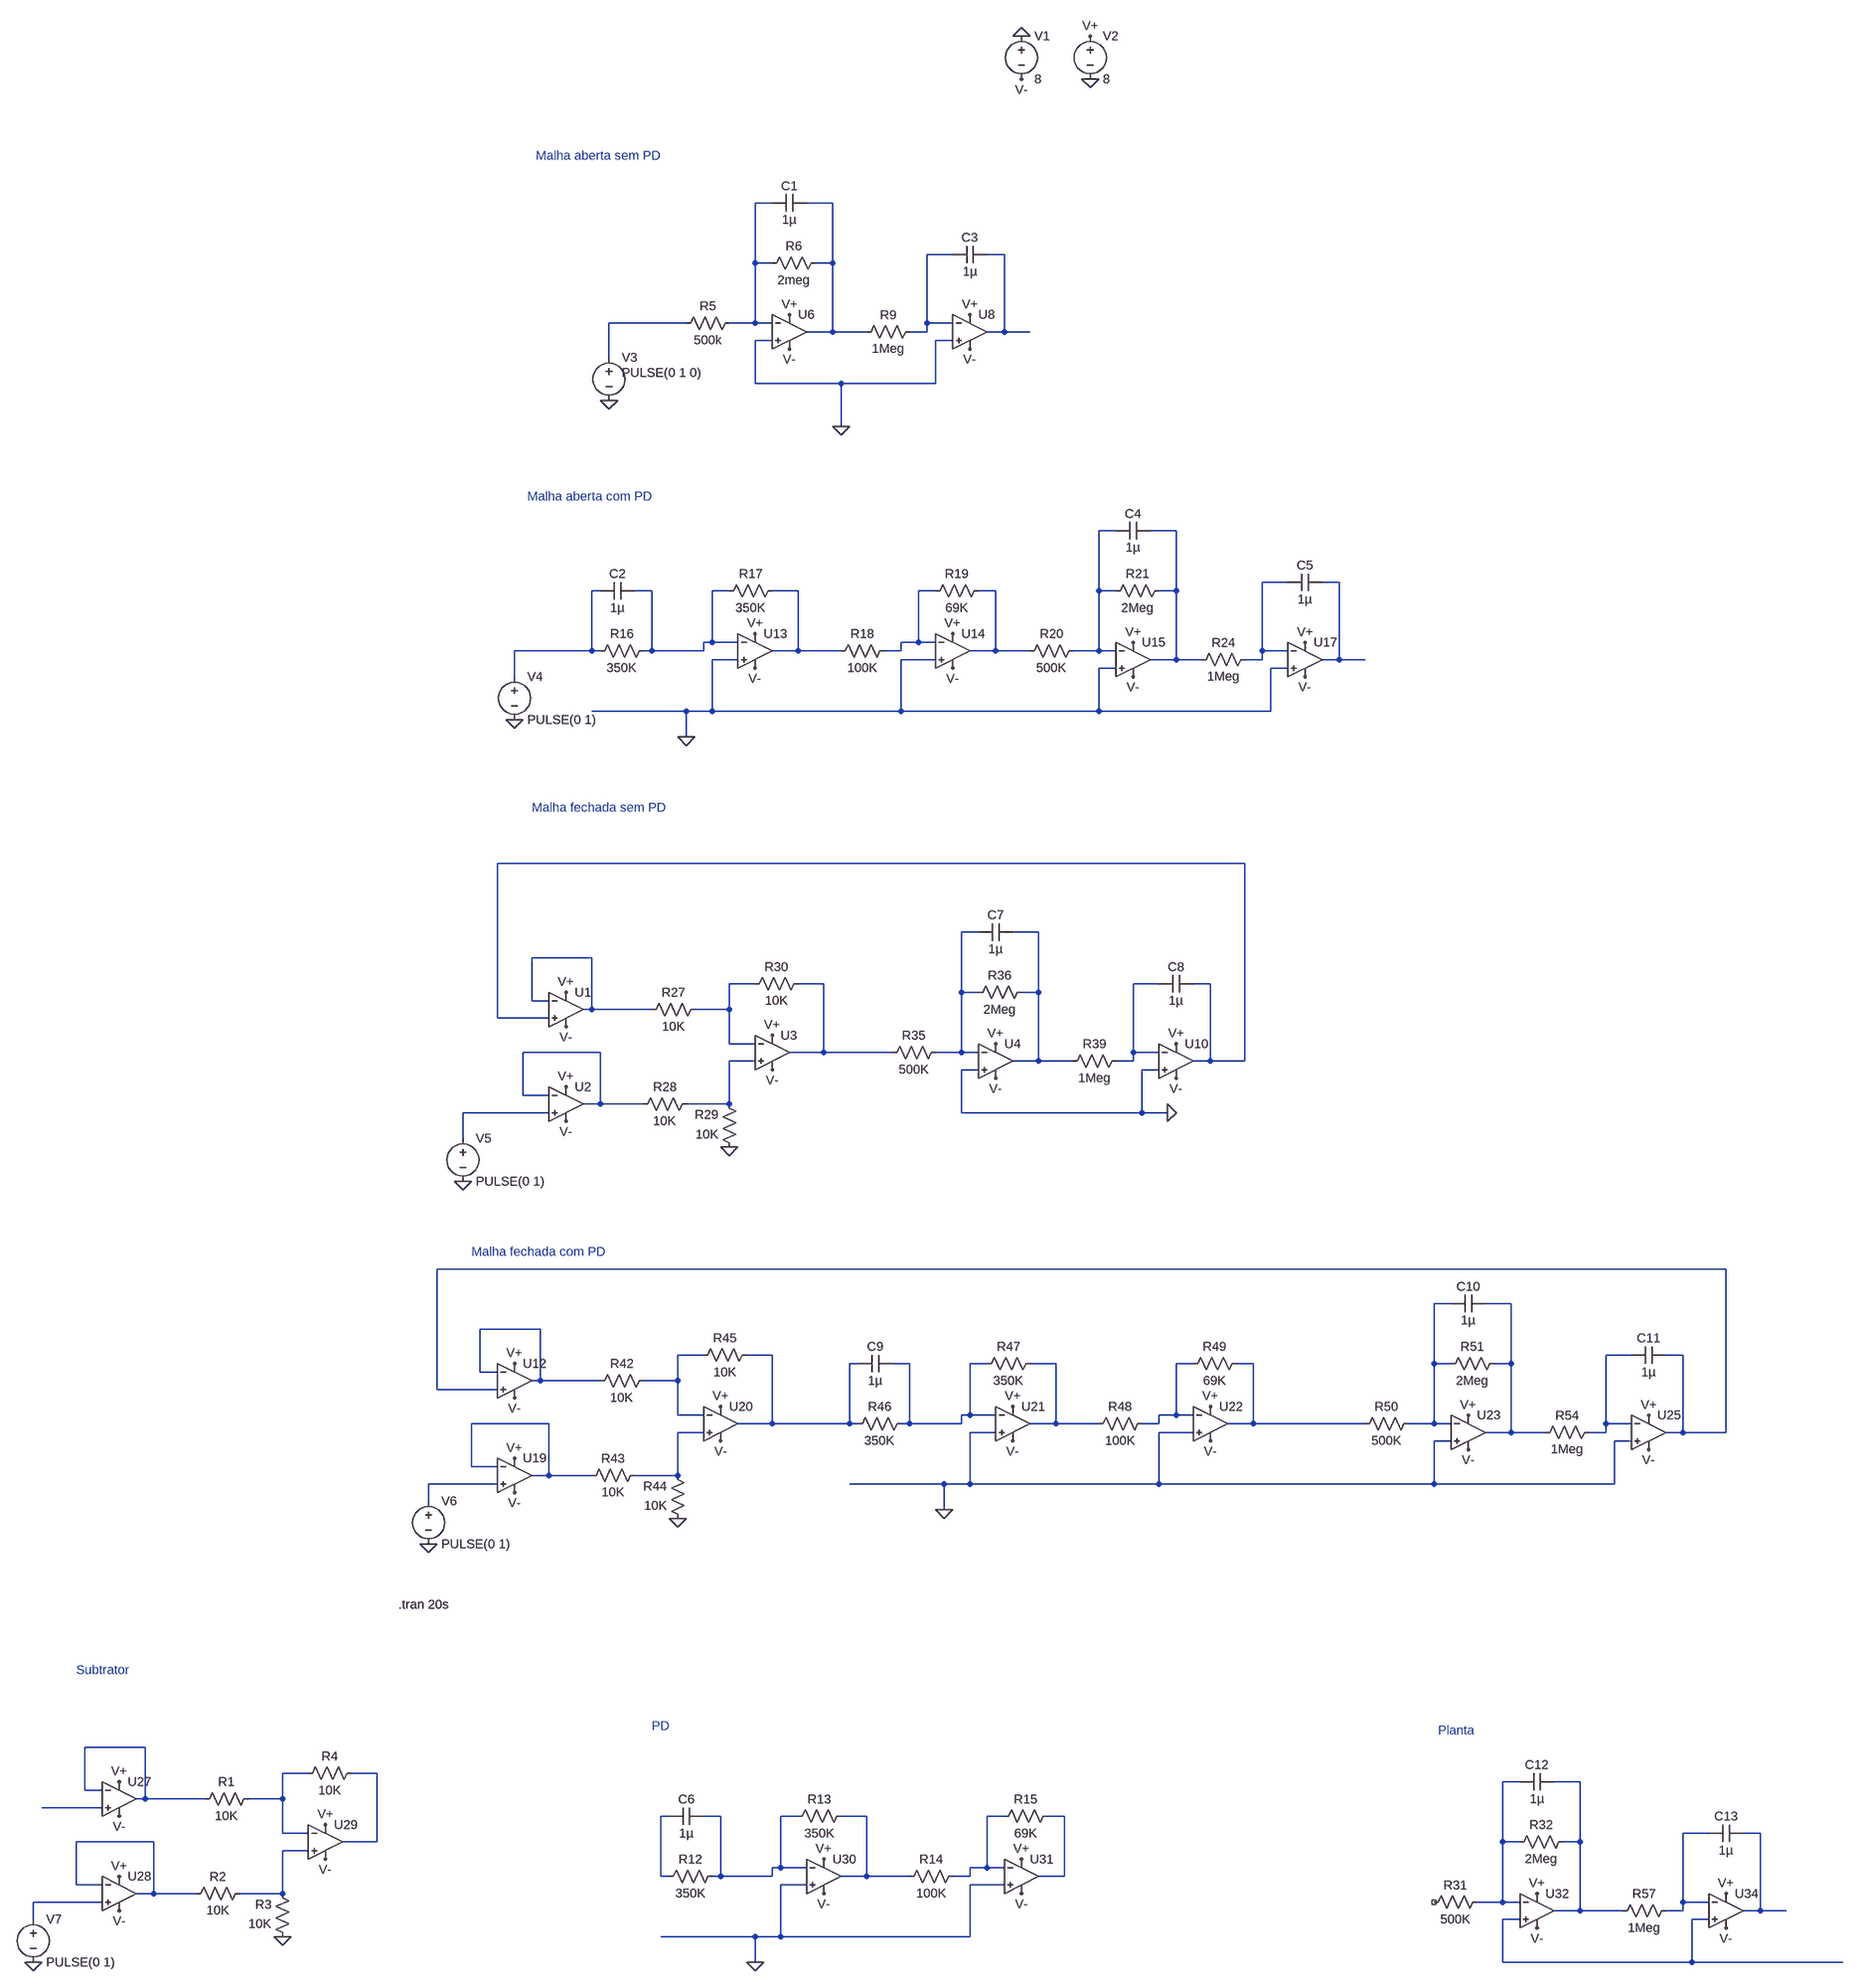
[diagram p0: schematic ProjetoControle.asc]
ProjetoControle.asc, the LTspice schematic file:
Version 4
SHEET 1 2676 3508
WIRE -224 -80 -256 -80
WIRE -112 -80 -160 -80
WIRE 112 16 64 16
WIRE 208 16 176 16
WIRE -256 32 -256 -80
WIRE -224 32 -256 32
WIRE -112 32 -112 -80
WIRE -112 32 -144 32
WIRE -384 144 -528 144
WIRE -256 144 -256 32
WIRE -256 144 -304 144
WIRE -224 144 -256 144
WIRE 64 144 64 16
WIRE 112 144 64 144
WIRE -112 160 -112 32
WIRE -112 160 -160 160
WIRE -48 160 -112 160
WIRE 64 160 64 144
WIRE 64 160 32 160
WIRE 208 160 208 16
WIRE 208 160 176 160
WIRE 256 160 208 160
WIRE -224 176 -256 176
WIRE 112 176 80 176
WIRE -528 208 -528 144
WIRE -256 256 -256 176
WIRE -96 256 -256 256
WIRE 80 256 80 176
WIRE 80 256 -96 256
WIRE -96 336 -96 256
WIRE 416 640 384 640
WIRE 528 640 480 640
WIRE 736 736 688 736
WIRE 832 736 800 736
WIRE -544 752 -560 752
WIRE -448 752 -480 752
WIRE -304 752 -336 752
WIRE -176 752 -224 752
WIRE 80 752 48 752
WIRE 192 752 160 752
WIRE 384 752 384 640
WIRE 416 752 384 752
WIRE 528 752 528 640
WIRE 528 752 496 752
WIRE -336 848 -336 752
WIRE -336 848 -352 848
WIRE -288 848 -336 848
WIRE 48 848 48 752
WIRE 48 848 16 848
WIRE 80 848 48 848
WIRE -560 864 -560 752
WIRE -560 864 -704 864
WIRE -544 864 -560 864
WIRE -448 864 -448 752
WIRE -448 864 -464 864
WIRE -352 864 -352 848
WIRE -352 864 -448 864
WIRE -176 864 -176 752
WIRE -176 864 -224 864
WIRE -96 864 -176 864
WIRE 16 864 16 848
WIRE 16 864 -16 864
WIRE 192 864 192 752
WIRE 192 864 144 864
WIRE 256 864 192 864
WIRE 384 864 384 752
WIRE 384 864 336 864
WIRE 416 864 384 864
WIRE 688 864 688 736
WIRE 736 864 688 864
WIRE -288 880 -336 880
WIRE 80 880 16 880
WIRE 528 880 528 752
WIRE 528 880 480 880
WIRE 576 880 528 880
WIRE 688 880 688 864
WIRE 688 880 656 880
WIRE 832 880 832 736
WIRE 832 880 800 880
WIRE 880 880 832 880
WIRE 416 896 384 896
WIRE 736 896 704 896
WIRE -704 912 -704 864
WIRE -384 976 -560 976
WIRE -336 976 -336 880
WIRE -336 976 -384 976
WIRE 16 976 16 880
WIRE 16 976 -336 976
WIRE 384 976 384 896
WIRE 384 976 16 976
WIRE 704 976 704 896
WIRE 704 976 384 976
WIRE -384 1024 -384 976
WIRE 656 1296 -736 1296
WIRE 160 1424 128 1424
WIRE 272 1424 224 1424
WIRE -560 1472 -672 1472
WIRE -256 1520 -304 1520
WIRE -128 1520 -176 1520
WIRE 496 1520 448 1520
WIRE 592 1520 560 1520
WIRE 128 1536 128 1424
WIRE 160 1536 128 1536
WIRE 272 1536 272 1424
WIRE 272 1536 240 1536
WIRE -672 1552 -672 1472
WIRE -640 1552 -672 1552
WIRE -560 1568 -560 1472
WIRE -560 1568 -576 1568
WIRE -448 1568 -560 1568
WIRE -304 1568 -304 1520
WIRE -304 1568 -368 1568
WIRE -736 1584 -736 1296
WIRE -640 1584 -736 1584
WIRE -304 1632 -304 1568
WIRE -256 1632 -304 1632
WIRE -544 1648 -688 1648
WIRE -128 1648 -128 1520
WIRE -128 1648 -192 1648
WIRE 0 1648 -128 1648
WIRE 128 1648 128 1536
WIRE 128 1648 80 1648
WIRE 160 1648 128 1648
WIRE 448 1648 448 1520
WIRE 496 1648 448 1648
WIRE -256 1664 -304 1664
WIRE 272 1664 272 1536
WIRE 272 1664 224 1664
WIRE 336 1664 272 1664
WIRE 448 1664 448 1648
WIRE 448 1664 416 1664
WIRE 592 1664 592 1520
WIRE 592 1664 560 1664
WIRE 656 1664 656 1296
WIRE 656 1664 592 1664
WIRE 160 1680 128 1680
WIRE 496 1680 464 1680
WIRE -688 1728 -688 1648
WIRE -640 1728 -688 1728
WIRE -544 1744 -544 1648
WIRE -544 1744 -576 1744
WIRE -464 1744 -544 1744
WIRE -304 1744 -304 1664
WIRE -304 1744 -384 1744
WIRE -640 1760 -800 1760
WIRE 128 1760 128 1680
WIRE 464 1760 464 1680
WIRE 464 1760 128 1760
WIRE 512 1760 464 1760
WIRE -800 1808 -800 1760
WIRE 1552 2096 -848 2096
WIRE 1040 2160 1008 2160
WIRE 1152 2160 1104 2160
WIRE -656 2208 -768 2208
WIRE -352 2256 -400 2256
WIRE -224 2256 -272 2256
WIRE 1376 2256 1328 2256
WIRE 1472 2256 1440 2256
WIRE -64 2272 -80 2272
WIRE 32 2272 0 2272
WIRE 176 2272 144 2272
WIRE 304 2272 256 2272
WIRE 560 2272 528 2272
WIRE 672 2272 640 2272
WIRE 1008 2272 1008 2160
WIRE 1040 2272 1008 2272
WIRE 1152 2272 1152 2160
WIRE 1152 2272 1120 2272
WIRE -768 2288 -768 2208
WIRE -736 2288 -768 2288
WIRE -656 2304 -656 2208
WIRE -656 2304 -672 2304
WIRE -544 2304 -656 2304
WIRE -400 2304 -400 2256
WIRE -400 2304 -464 2304
WIRE -848 2320 -848 2096
WIRE -736 2320 -848 2320
WIRE -400 2368 -400 2304
WIRE -352 2368 -400 2368
WIRE 144 2368 144 2272
WIRE 144 2368 128 2368
WIRE 192 2368 144 2368
WIRE 528 2368 528 2272
WIRE 528 2368 496 2368
WIRE 560 2368 528 2368
WIRE -640 2384 -784 2384
WIRE -224 2384 -224 2256
WIRE -224 2384 -288 2384
WIRE -80 2384 -80 2272
WIRE -80 2384 -224 2384
WIRE -64 2384 -80 2384
WIRE 32 2384 32 2272
WIRE 32 2384 16 2384
WIRE 128 2384 128 2368
WIRE 128 2384 32 2384
WIRE 304 2384 304 2272
WIRE 304 2384 256 2384
WIRE 384 2384 304 2384
WIRE 496 2384 496 2368
WIRE 496 2384 464 2384
WIRE 672 2384 672 2272
WIRE 672 2384 624 2384
WIRE 880 2384 672 2384
WIRE 1008 2384 1008 2272
WIRE 1008 2384 960 2384
WIRE 1040 2384 1008 2384
WIRE 1328 2384 1328 2256
WIRE 1376 2384 1328 2384
WIRE -352 2400 -400 2400
WIRE 192 2400 144 2400
WIRE 560 2400 496 2400
WIRE 1152 2400 1152 2272
WIRE 1152 2400 1104 2400
WIRE 1216 2400 1152 2400
WIRE 1328 2400 1328 2384
WIRE 1328 2400 1296 2400
WIRE 1472 2400 1472 2256
WIRE 1472 2400 1440 2400
WIRE 1552 2400 1552 2096
WIRE 1552 2400 1472 2400
WIRE 1040 2416 1008 2416
WIRE 1376 2416 1344 2416
WIRE -784 2464 -784 2384
WIRE -736 2464 -784 2464
WIRE -640 2480 -640 2384
WIRE -640 2480 -672 2480
WIRE -560 2480 -640 2480
WIRE -400 2480 -400 2400
WIRE -400 2480 -480 2480
WIRE -736 2496 -864 2496
WIRE 96 2496 -80 2496
WIRE 144 2496 144 2400
WIRE 144 2496 96 2496
WIRE 496 2496 496 2400
WIRE 496 2496 144 2496
WIRE 1008 2496 1008 2416
WIRE 1008 2496 496 2496
WIRE 1344 2496 1344 2416
WIRE 1344 2496 1008 2496
WIRE -864 2528 -864 2496
WIRE 96 2544 96 2496
WIRE -1392 3088 -1504 3088
WIRE -1088 3136 -1136 3136
WIRE -960 3136 -1008 3136
WIRE 1168 3152 1136 3152
WIRE 1280 3152 1232 3152
WIRE -1504 3168 -1504 3088
WIRE -1472 3168 -1504 3168
WIRE -1392 3184 -1392 3088
WIRE -1392 3184 -1408 3184
WIRE -1280 3184 -1392 3184
WIRE -1136 3184 -1136 3136
WIRE -1136 3184 -1200 3184
WIRE -1472 3200 -1584 3200
WIRE -416 3216 -432 3216
WIRE -320 3216 -352 3216
WIRE -176 3216 -208 3216
WIRE -48 3216 -96 3216
WIRE 208 3216 176 3216
WIRE 320 3216 288 3216
WIRE -1136 3248 -1136 3184
WIRE -1088 3248 -1136 3248
WIRE 1520 3248 1472 3248
WIRE 1616 3248 1584 3248
WIRE -1376 3264 -1520 3264
WIRE -960 3264 -960 3136
WIRE -960 3264 -1024 3264
WIRE 1136 3264 1136 3152
WIRE 1168 3264 1136 3264
WIRE 1280 3264 1280 3152
WIRE 1280 3264 1248 3264
WIRE -1088 3280 -1136 3280
WIRE -208 3312 -208 3216
WIRE -208 3312 -224 3312
WIRE -160 3312 -208 3312
WIRE 176 3312 176 3216
WIRE 176 3312 144 3312
WIRE 208 3312 176 3312
WIRE -432 3328 -432 3216
WIRE -416 3328 -432 3328
WIRE -320 3328 -320 3216
WIRE -320 3328 -336 3328
WIRE -224 3328 -224 3312
WIRE -224 3328 -320 3328
WIRE -48 3328 -48 3216
WIRE -48 3328 -96 3328
WIRE 32 3328 -48 3328
WIRE 144 3328 144 3312
WIRE 144 3328 112 3328
WIRE 320 3328 320 3216
WIRE 320 3328 272 3328
WIRE -1520 3344 -1520 3264
WIRE -1472 3344 -1520 3344
WIRE -160 3344 -208 3344
WIRE 208 3344 144 3344
WIRE -1376 3360 -1376 3264
WIRE -1376 3360 -1408 3360
WIRE -1296 3360 -1376 3360
WIRE -1136 3360 -1136 3280
WIRE -1136 3360 -1216 3360
WIRE -1472 3376 -1600 3376
WIRE 1136 3376 1136 3264
WIRE 1136 3376 1088 3376
WIRE 1168 3376 1136 3376
WIRE 1472 3376 1472 3248
WIRE 1520 3376 1472 3376
WIRE 1280 3392 1280 3264
WIRE 1280 3392 1232 3392
WIRE 1360 3392 1280 3392
WIRE 1472 3392 1472 3376
WIRE 1472 3392 1440 3392
WIRE 1616 3392 1616 3248
WIRE 1616 3392 1584 3392
WIRE 1664 3392 1616 3392
WIRE -1600 3408 -1600 3376
WIRE 1168 3408 1136 3408
WIRE 1520 3408 1488 3408
WIRE -256 3440 -432 3440
WIRE -208 3440 -208 3344
WIRE -208 3440 -256 3440
WIRE 144 3440 144 3344
WIRE 144 3440 -208 3440
WIRE -256 3488 -256 3440
WIRE 1136 3488 1136 3408
WIRE 1488 3488 1488 3408
WIRE 1488 3488 1136 3488
WIRE 1776 3488 1488 3488
FLAG 368 -512 0
FLAG 240 -592 0
FLAG 368 -592 V+
FLAG -192 128 V+
FLAG 144 128 V+
FLAG 240 -512 V-
FLAG -192 192 V-
FLAG 144 192 V-
FLAG -384 1024 0
FLAG -256 832 V+
FLAG 112 832 V+
FLAG 448 848 V+
FLAG 768 848 V+
FLAG -256 896 V-
FLAG 112 896 V-
FLAG 448 912 V-
FLAG 768 912 V-
FLAG -304 1824 0
FLAG -608 1536 V+
FLAG -608 1712 V+
FLAG -224 1616 V+
FLAG 192 1632 V+
FLAG 528 1632 V+
FLAG -608 1600 V-
FLAG -608 1776 V-
FLAG -224 1680 V-
FLAG 192 1696 V-
FLAG 528 1696 V-
FLAG -400 2560 0
FLAG 96 2544 0
FLAG -704 2272 V+
FLAG -704 2448 V+
FLAG -320 2352 V+
FLAG 224 2352 V+
FLAG 592 2352 V+
FLAG 1072 2368 V+
FLAG 1408 2368 V+
FLAG -704 2336 V-
FLAG -704 2512 V-
FLAG -320 2416 V-
FLAG 224 2416 V-
FLAG 592 2416 V-
FLAG 1072 2432 V-
FLAG 1408 2432 V-
FLAG 512 1760 0
FLAG -704 992 0
FLAG -800 1888 0
FLAG -864 2608 0
FLAG -528 288 0
FLAG -96 336 0
FLAG -1136 3440 0
FLAG -256 3488 0
FLAG -1440 3152 V+
FLAG -1440 3328 V+
FLAG -1056 3232 V+
FLAG -128 3296 V+
FLAG 240 3296 V+
FLAG 1200 3360 V+
FLAG 1552 3360 V+
FLAG -1440 3216 V-
FLAG -1440 3392 V-
FLAG -1056 3296 V-
FLAG -128 3360 V-
FLAG 240 3360 V-
FLAG 1200 3424 V-
FLAG 1552 3424 V-
FLAG -1600 3488 0
SYMBOL res -288 128 R90
WINDOW 0 0 56 VBottom 2
WINDOW 3 32 56 VTop 2
SYMATTR InstName R5
SYMATTR Value 500k
SYMBOL res -128 16 R90
WINDOW 0 0 56 VBottom 2
WINDOW 3 32 56 VTop 2
SYMATTR InstName R6
SYMATTR Value 2meg
SYMBOL res 48 144 R90
WINDOW 0 0 56 VBottom 2
WINDOW 3 32 56 VTop 2
SYMATTR InstName R9
SYMATTR Value 1Meg
SYMBOL cap -160 -96 R90
WINDOW 0 0 32 VBottom 2
WINDOW 3 32 32 VTop 2
SYMATTR InstName C1
SYMATTR Value 1µ
SYMBOL cap 176 0 R90
WINDOW 0 0 32 VBottom 2
WINDOW 3 32 32 VTop 2
SYMATTR InstName C3
SYMATTR Value 1µ
SYMBOL voltage 240 -608 R0
WINDOW 123 0 0 Left 2
WINDOW 39 0 0 Left 2
SYMATTR InstName V1
SYMATTR Value 8
SYMBOL voltage 368 -608 R0
WINDOW 123 0 0 Left 2
WINDOW 39 0 0 Left 2
SYMATTR InstName V2
SYMATTR Value 8
SYMBOL res -448 848 R90
WINDOW 0 0 56 VBottom 2
WINDOW 3 32 56 VTop 2
SYMATTR InstName R16
SYMATTR Value 350K
SYMBOL cap -480 736 R90
WINDOW 0 0 32 VBottom 2
WINDOW 3 32 32 VTop 2
SYMATTR InstName C2
SYMATTR Value 1µ
SYMBOL res -208 736 R90
WINDOW 0 0 56 VBottom 2
WINDOW 3 32 56 VTop 2
SYMATTR InstName R17
SYMATTR Value 350K
SYMBOL res 0 848 R90
WINDOW 0 0 56 VBottom 2
WINDOW 3 32 56 VTop 2
SYMATTR InstName R18
SYMATTR Value 100K
SYMBOL res 176 736 R90
WINDOW 0 0 56 VBottom 2
WINDOW 3 32 56 VTop 2
SYMATTR InstName R19
SYMATTR Value 69K
SYMBOL res 352 848 R90
WINDOW 0 0 56 VBottom 2
WINDOW 3 32 56 VTop 2
SYMATTR InstName R20
SYMATTR Value 500K
SYMBOL res 512 736 R90
WINDOW 0 0 56 VBottom 2
WINDOW 3 32 56 VTop 2
SYMATTR InstName R21
SYMATTR Value 2Meg
SYMBOL res 672 864 R90
WINDOW 0 0 56 VBottom 2
WINDOW 3 32 56 VTop 2
SYMATTR InstName R24
SYMATTR Value 1Meg
SYMBOL cap 480 624 R90
WINDOW 0 0 32 VBottom 2
WINDOW 3 32 32 VTop 2
SYMATTR InstName C4
SYMATTR Value 1µ
SYMBOL cap 800 720 R90
WINDOW 0 0 32 VBottom 2
WINDOW 3 32 32 VTop 2
SYMATTR InstName C5
SYMATTR Value 1µ
SYMBOL res -352 1552 R90
WINDOW 0 0 56 VBottom 2
WINDOW 3 32 56 VTop 2
SYMATTR InstName R27
SYMATTR Value 10K
SYMBOL res -368 1728 R90
WINDOW 0 0 56 VBottom 2
WINDOW 3 32 56 VTop 2
SYMATTR InstName R28
SYMATTR Value 10K
SYMBOL res -288 1840 R180
WINDOW 0 36 76 Left 2
WINDOW 3 36 40 Left 2
SYMATTR InstName R29
SYMATTR Value 10K
SYMBOL res -272 1536 R270
WINDOW 0 32 56 VTop 2
WINDOW 3 0 56 VBottom 2
SYMATTR InstName R30
SYMATTR Value 10K
SYMBOL res 96 1632 R90
WINDOW 0 0 56 VBottom 2
WINDOW 3 32 56 VTop 2
SYMATTR InstName R35
SYMATTR Value 500K
SYMBOL res 256 1520 R90
WINDOW 0 0 56 VBottom 2
WINDOW 3 32 56 VTop 2
SYMATTR InstName R36
SYMATTR Value 2Meg
SYMBOL res 432 1648 R90
WINDOW 0 0 56 VBottom 2
WINDOW 3 32 56 VTop 2
SYMATTR InstName R39
SYMATTR Value 1Meg
SYMBOL cap 224 1408 R90
WINDOW 0 0 32 VBottom 2
WINDOW 3 32 32 VTop 2
SYMATTR InstName C7
SYMATTR Value 1µ
SYMBOL cap 560 1504 R90
WINDOW 0 0 32 VBottom 2
WINDOW 3 32 32 VTop 2
SYMATTR InstName C8
SYMATTR Value 1µ
SYMBOL res -448 2288 R90
WINDOW 0 0 56 VBottom 2
WINDOW 3 32 56 VTop 2
SYMATTR InstName R42
SYMATTR Value 10K
SYMBOL res -464 2464 R90
WINDOW 0 0 56 VBottom 2
WINDOW 3 32 56 VTop 2
SYMATTR InstName R43
SYMATTR Value 10K
SYMBOL res -384 2576 R180
WINDOW 0 36 76 Left 2
WINDOW 3 36 40 Left 2
SYMATTR InstName R44
SYMATTR Value 10K
SYMBOL res -368 2272 R270
WINDOW 0 32 56 VTop 2
WINDOW 3 0 56 VBottom 2
SYMATTR InstName R45
SYMATTR Value 10K
SYMBOL res 32 2368 R90
WINDOW 0 0 56 VBottom 2
WINDOW 3 32 56 VTop 2
SYMATTR InstName R46
SYMATTR Value 350K
SYMBOL cap 0 2256 R90
WINDOW 0 0 32 VBottom 2
WINDOW 3 32 32 VTop 2
SYMATTR InstName C9
SYMATTR Value 1µ
SYMBOL res 272 2256 R90
WINDOW 0 0 56 VBottom 2
WINDOW 3 32 56 VTop 2
SYMATTR InstName R47
SYMATTR Value 350K
SYMBOL res 480 2368 R90
WINDOW 0 0 56 VBottom 2
WINDOW 3 32 56 VTop 2
SYMATTR InstName R48
SYMATTR Value 100K
SYMBOL res 656 2256 R90
WINDOW 0 0 56 VBottom 2
WINDOW 3 32 56 VTop 2
SYMATTR InstName R49
SYMATTR Value 69K
SYMBOL res 976 2368 R90
WINDOW 0 0 56 VBottom 2
WINDOW 3 32 56 VTop 2
SYMATTR InstName R50
SYMATTR Value 500K
SYMBOL res 1136 2256 R90
WINDOW 0 0 56 VBottom 2
WINDOW 3 32 56 VTop 2
SYMATTR InstName R51
SYMATTR Value 2Meg
SYMBOL res 1312 2384 R90
WINDOW 0 0 56 VBottom 2
WINDOW 3 32 56 VTop 2
SYMATTR InstName R54
SYMATTR Value 1Meg
SYMBOL cap 1104 2144 R90
WINDOW 0 0 32 VBottom 2
WINDOW 3 32 32 VTop 2
SYMATTR InstName C10
SYMATTR Value 1µ
SYMBOL cap 1440 2240 R90
WINDOW 0 0 32 VBottom 2
WINDOW 3 32 32 VTop 2
SYMATTR InstName C11
SYMATTR Value 1µ
SYMBOL voltage -528 192 R0
WINDOW 3 24 44 Left 2
WINDOW 123 0 0 Left 2
WINDOW 39 0 0 Left 2
SYMATTR Value PULSE(0 1 0)
SYMATTR InstName V3
SYMBOL voltage -704 896 R0
WINDOW 123 0 0 Left 2
WINDOW 39 0 0 Left 2
SYMATTR InstName V4
SYMATTR Value PULSE(0 1)
SYMBOL voltage -800 1792 R0
WINDOW 123 0 0 Left 2
WINDOW 39 0 0 Left 2
SYMATTR InstName V5
SYMATTR Value PULSE(0 1)
SYMBOL voltage -864 2512 R0
WINDOW 123 0 0 Left 2
WINDOW 39 0 0 Left 2
SYMATTR InstName V6
SYMATTR Value PULSE(0 1)
SYMBOL Opamps\\UniversalOpamp2 -608 1568 R0
SYMATTR InstName U1
SYMBOL Opamps\\UniversalOpamp2 -608 1744 R0
SYMATTR InstName U2
SYMBOL Opamps\\UniversalOpamp2 -224 1648 R0
SYMATTR InstName U3
SYMBOL Opamps\\UniversalOpamp2 192 1664 R0
SYMATTR InstName U4
SYMBOL Opamps\\UniversalOpamp2 528 1664 R0
SYMATTR InstName U10
SYMBOL Opamps\\UniversalOpamp2 -704 2304 R0
SYMATTR InstName U12
SYMBOL Opamps\\UniversalOpamp2 -704 2480 R0
SYMATTR InstName U19
SYMBOL Opamps\\UniversalOpamp2 -320 2384 R0
SYMATTR InstName U20
SYMBOL Opamps\\UniversalOpamp2 224 2384 R0
SYMATTR InstName U21
SYMBOL Opamps\\UniversalOpamp2 592 2384 R0
SYMATTR InstName U22
SYMBOL Opamps\\UniversalOpamp2 1072 2400 R0
SYMATTR InstName U23
SYMBOL Opamps\\UniversalOpamp2 1408 2400 R0
SYMATTR InstName U25
SYMBOL Opamps\\UniversalOpamp2 -192 160 R0
SYMATTR InstName U6
SYMBOL Opamps\\UniversalOpamp2 144 160 R0
SYMATTR InstName U8
SYMBOL Opamps\\UniversalOpamp2 -256 864 R0
SYMATTR InstName U13
SYMBOL Opamps\\UniversalOpamp2 112 864 R0
SYMATTR InstName U14
SYMBOL Opamps\\UniversalOpamp2 448 880 R0
SYMATTR InstName U15
SYMBOL Opamps\\UniversalOpamp2 768 880 R0
SYMATTR InstName U17
SYMBOL res -1184 3168 R90
WINDOW 0 0 56 VBottom 2
WINDOW 3 32 56 VTop 2
SYMATTR InstName R1
SYMATTR Value 10K
SYMBOL res -1200 3344 R90
WINDOW 0 0 56 VBottom 2
WINDOW 3 32 56 VTop 2
SYMATTR InstName R2
SYMATTR Value 10K
SYMBOL res -1120 3456 R180
WINDOW 0 36 76 Left 2
WINDOW 3 36 40 Left 2
SYMATTR InstName R3
SYMATTR Value 10K
SYMBOL res -1104 3152 R270
WINDOW 0 32 56 VTop 2
WINDOW 3 0 56 VBottom 2
SYMATTR InstName R4
SYMATTR Value 10K
SYMBOL res -320 3312 R90
WINDOW 0 0 56 VBottom 2
WINDOW 3 32 56 VTop 2
SYMATTR InstName R12
SYMATTR Value 350K
SYMBOL cap -352 3200 R90
WINDOW 0 0 32 VBottom 2
WINDOW 3 32 32 VTop 2
SYMATTR InstName C6
SYMATTR Value 1µ
SYMBOL res -80 3200 R90
WINDOW 0 0 56 VBottom 2
WINDOW 3 32 56 VTop 2
SYMATTR InstName R13
SYMATTR Value 350K
SYMBOL res 128 3312 R90
WINDOW 0 0 56 VBottom 2
WINDOW 3 32 56 VTop 2
SYMATTR InstName R14
SYMATTR Value 100K
SYMBOL res 304 3200 R90
WINDOW 0 0 56 VBottom 2
WINDOW 3 32 56 VTop 2
SYMATTR InstName R15
SYMATTR Value 69K
SYMBOL res 1104 3360 R90
WINDOW 0 0 56 VBottom 2
WINDOW 3 32 56 VTop 2
SYMATTR InstName R31
SYMATTR Value 500K
SYMBOL res 1264 3248 R90
WINDOW 0 0 56 VBottom 2
WINDOW 3 32 56 VTop 2
SYMATTR InstName R32
SYMATTR Value 2Meg
SYMBOL res 1456 3376 R90
WINDOW 0 0 56 VBottom 2
WINDOW 3 32 56 VTop 2
SYMATTR InstName R57
SYMATTR Value 1Meg
SYMBOL cap 1232 3136 R90
WINDOW 0 0 32 VBottom 2
WINDOW 3 32 32 VTop 2
SYMATTR InstName C12
SYMATTR Value 1µ
SYMBOL cap 1584 3232 R90
WINDOW 0 0 32 VBottom 2
WINDOW 3 32 32 VTop 2
SYMATTR InstName C13
SYMATTR Value 1µ
SYMBOL voltage -1600 3392 R0
WINDOW 123 0 0 Left 2
WINDOW 39 0 0 Left 2
SYMATTR InstName V7
SYMATTR Value PULSE(0 1)
SYMBOL Opamps\\UniversalOpamp2 -1440 3184 R0
SYMATTR InstName U27
SYMBOL Opamps\\UniversalOpamp2 -1440 3360 R0
SYMATTR InstName U28
SYMBOL Opamps\\UniversalOpamp2 -1056 3264 R0
SYMATTR InstName U29
SYMBOL Opamps\\UniversalOpamp2 -128 3328 R0
SYMATTR InstName U30
SYMBOL Opamps\\UniversalOpamp2 240 3328 R0
SYMATTR InstName U31
SYMBOL Opamps\\UniversalOpamp2 1200 3392 R0
SYMATTR InstName U32
SYMBOL Opamps\\UniversalOpamp2 1552 3392 R0
SYMATTR InstName U34
TEXT -664 -168 Left 2 ;Malha aberta sem PD
TEXT -680 576 Left 2 ;Malha aberta com PD
TEXT -672 1192 Left 2 ;Malha fechada sem PD
TEXT -784 2064 Left 2 ;Malha fechada com PD
TEXT -920 2720 Left 2 !.tran 20s
TEXT -1520 2944 Left 2 ;Subtrator
TEXT -448 3048 Left 2 ;PD
TEXT 1016 3056 Left 2 ;Planta

The netlist it stands for:
* ProjetoControle.asc
R5 N001 N005 500k
R6 N002 N001 2meg
R9 N003 N002 1Meg
C1 N002 N001 1µ
C3 N004 N003 1µ
V1 0 V- 8
V2 V+ 0 8
R16 N011 N010 350K
C2 N011 N010 1µ
R17 N012 N011 350K
R18 N013 N012 100K
R19 N014 N013 69K
R20 N006 N014 500K
R21 N007 N006 2Meg
R24 N008 N007 1Meg
C4 N007 N006 1µ
C5 N009 N008 1µ
R27 N019 N018 10K
R28 N023 N022 10K
R29 0 N023 10K
R30 N019 N020 10K
R35 N016 N020 500K
R36 N017 N016 2Meg
R39 N021 N017 1Meg
C7 N017 N016 1µ
C8 N015 N021 1µ
R42 N029 N028 10K
R43 N037 N036 10K
R44 0 N037 10K
R45 N029 N030 10K
R46 N032 N030 350K
C9 N032 N030 1µ
R47 N033 N032 350K
R48 N034 N033 100K
R49 N035 N034 69K
R50 N026 N035 500K
R51 N027 N026 2Meg
R54 N031 N027 1Meg
C10 N027 N026 1µ
C11 N025 N031 1µ
V3 N005 0 PULSE(0 1 0)
V4 N010 0 PULSE(0 1)
V5 N024 0 PULSE(0 1)
V6 N038 0 PULSE(0 1)
XU1 N015 N018 V+ V- N018 level.2 Avol=1Meg GBW=10Meg Slew=10Meg ilimit=25m rail=0 Vos=0 phimargin=45 en=0 enk=0 in=0 ink=0 Rin=500Meg  ; pins IN+ IN- V+ V- OUT
XU2 N024 N022 V+ V- N022 level.2 Avol=1Meg GBW=10Meg Slew=10Meg ilimit=25m rail=0 Vos=0 phimargin=45 en=0 enk=0 in=0 ink=0 Rin=500Meg  ; pins IN+ IN- V+ V- OUT
XU3 N023 N019 V+ V- N020 level.2 Avol=1Meg GBW=10Meg Slew=10Meg ilimit=25m rail=0 Vos=0 phimargin=45 en=0 enk=0 in=0 ink=0 Rin=500Meg  ; pins IN+ IN- V+ V- OUT
XU4 0 N016 V+ V- N017 level.2 Avol=1Meg GBW=10Meg Slew=10Meg ilimit=25m rail=0 Vos=0 phimargin=45 en=0 enk=0 in=0 ink=0 Rin=500Meg  ; pins IN+ IN- V+ V- OUT
XU10 0 N021 V+ V- N015 level.2 Avol=1Meg GBW=10Meg Slew=10Meg ilimit=25m rail=0 Vos=0 phimargin=45 en=0 enk=0 in=0 ink=0 Rin=500Meg  ; pins IN+ IN- V+ V- OUT
XU12 N025 N028 V+ V- N028 level.2 Avol=1Meg GBW=10Meg Slew=10Meg ilimit=25m rail=0 Vos=0 phimargin=45 en=0 enk=0 in=0 ink=0 Rin=500Meg  ; pins IN+ IN- V+ V- OUT
XU19 N038 N036 V+ V- N036 level.2 Avol=1Meg GBW=10Meg Slew=10Meg ilimit=25m rail=0 Vos=0 phimargin=45 en=0 enk=0 in=0 ink=0 Rin=500Meg  ; pins IN+ IN- V+ V- OUT
XU20 N037 N029 V+ V- N030 level.2 Avol=1Meg GBW=10Meg Slew=10Meg ilimit=25m rail=0 Vos=0 phimargin=45 en=0 enk=0 in=0 ink=0 Rin=500Meg  ; pins IN+ IN- V+ V- OUT
XU21 0 N032 V+ V- N033 level.2 Avol=1Meg GBW=10Meg Slew=10Meg ilimit=25m rail=0 Vos=0 phimargin=45 en=0 enk=0 in=0 ink=0 Rin=500Meg  ; pins IN+ IN- V+ V- OUT
XU22 0 N034 V+ V- N035 level.2 Avol=1Meg GBW=10Meg Slew=10Meg ilimit=25m rail=0 Vos=0 phimargin=45 en=0 enk=0 in=0 ink=0 Rin=500Meg  ; pins IN+ IN- V+ V- OUT
XU23 0 N026 V+ V- N027 level.2 Avol=1Meg GBW=10Meg Slew=10Meg ilimit=25m rail=0 Vos=0 phimargin=45 en=0 enk=0 in=0 ink=0 Rin=500Meg  ; pins IN+ IN- V+ V- OUT
XU25 0 N031 V+ V- N025 level.2 Avol=1Meg GBW=10Meg Slew=10Meg ilimit=25m rail=0 Vos=0 phimargin=45 en=0 enk=0 in=0 ink=0 Rin=500Meg  ; pins IN+ IN- V+ V- OUT
XU6 0 N001 V+ V- N002 level.2 Avol=1Meg GBW=10Meg Slew=10Meg ilimit=25m rail=0 Vos=0 phimargin=45 en=0 enk=0 in=0 ink=0 Rin=500Meg  ; pins IN+ IN- V+ V- OUT
XU8 0 N003 V+ V- N004 level.2 Avol=1Meg GBW=10Meg Slew=10Meg ilimit=25m rail=0 Vos=0 phimargin=45 en=0 enk=0 in=0 ink=0 Rin=500Meg  ; pins IN+ IN- V+ V- OUT
XU13 0 N011 V+ V- N012 level.2 Avol=1Meg GBW=10Meg Slew=10Meg ilimit=25m rail=0 Vos=0 phimargin=45 en=0 enk=0 in=0 ink=0 Rin=500Meg  ; pins IN+ IN- V+ V- OUT
XU14 0 N013 V+ V- N014 level.2 Avol=1Meg GBW=10Meg Slew=10Meg ilimit=25m rail=0 Vos=0 phimargin=45 en=0 enk=0 in=0 ink=0 Rin=500Meg  ; pins IN+ IN- V+ V- OUT
XU15 0 N006 V+ V- N007 level.2 Avol=1Meg GBW=10Meg Slew=10Meg ilimit=25m rail=0 Vos=0 phimargin=45 en=0 enk=0 in=0 ink=0 Rin=500Meg  ; pins IN+ IN- V+ V- OUT
XU17 0 N008 V+ V- N009 level.2 Avol=1Meg GBW=10Meg Slew=10Meg ilimit=25m rail=0 Vos=0 phimargin=45 en=0 enk=0 in=0 ink=0 Rin=500Meg  ; pins IN+ IN- V+ V- OUT
R1 N040 N039 10K
R2 N053 N052 10K
R3 0 N053 10K
R4 N040 N041 10K
R12 N046 N045 350K
C6 N046 N045 1µ
R13 N047 N046 350K
R14 N048 N047 100K
R15 N049 N048 69K
R31 N042 NC_01 500K
R32 N043 N042 2Meg
R57 N050 N043 1Meg
C12 N043 N042 1µ
C13 N051 N050 1µ
V7 N054 0 PULSE(0 1)
XU27 N044 N039 V+ V- N039 level.2 Avol=1Meg GBW=10Meg Slew=10Meg ilimit=25m rail=0 Vos=0 phimargin=45 en=0 enk=0 in=0 ink=0 Rin=500Meg  ; pins IN+ IN- V+ V- OUT
XU28 N054 N052 V+ V- N052 level.2 Avol=1Meg GBW=10Meg Slew=10Meg ilimit=25m rail=0 Vos=0 phimargin=45 en=0 enk=0 in=0 ink=0 Rin=500Meg  ; pins IN+ IN- V+ V- OUT
XU29 N053 N040 V+ V- N041 level.2 Avol=1Meg GBW=10Meg Slew=10Meg ilimit=25m rail=0 Vos=0 phimargin=45 en=0 enk=0 in=0 ink=0 Rin=500Meg  ; pins IN+ IN- V+ V- OUT
XU30 0 N046 V+ V- N047 level.2 Avol=1Meg GBW=10Meg Slew=10Meg ilimit=25m rail=0 Vos=0 phimargin=45 en=0 enk=0 in=0 ink=0 Rin=500Meg  ; pins IN+ IN- V+ V- OUT
XU31 0 N048 V+ V- N049 level.2 Avol=1Meg GBW=10Meg Slew=10Meg ilimit=25m rail=0 Vos=0 phimargin=45 en=0 enk=0 in=0 ink=0 Rin=500Meg  ; pins IN+ IN- V+ V- OUT
XU32 N055 N042 V+ V- N043 level.2 Avol=1Meg GBW=10Meg Slew=10Meg ilimit=25m rail=0 Vos=0 phimargin=45 en=0 enk=0 in=0 ink=0 Rin=500Meg  ; pins IN+ IN- V+ V- OUT
XU34 N055 N050 V+ V- N051 level.2 Avol=1Meg GBW=10Meg Slew=10Meg ilimit=25m rail=0 Vos=0 phimargin=45 en=0 enk=0 in=0 ink=0 Rin=500Meg  ; pins IN+ IN- V+ V- OUT
* Malha aberta sem PD
* Malha aberta com PD
* Malha fechada sem PD
* Malha fechada com PD
.tran 20s
* Subtrator
* PD
* Planta
.lib UniversalOpamps2.sub
.backanno
.end